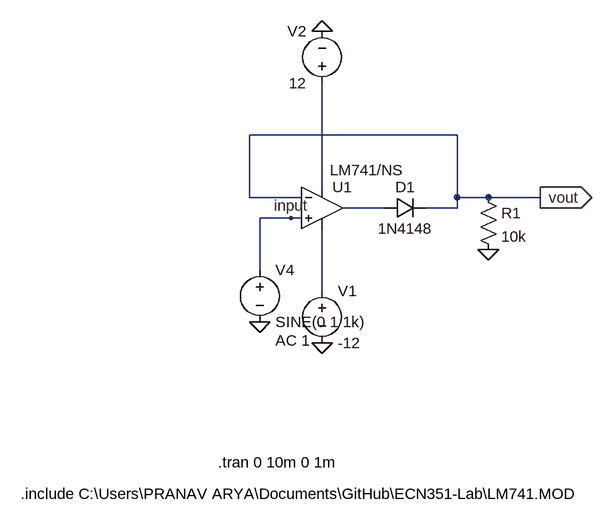
[diagram p0: schematic HalfWaweRectifier.asc]
HalfWaweRectifier.asc, the LTspice schematic file:
Version 4
SHEET 1 932 680
WIRE 672 -128 352 -128
WIRE 464 -48 464 -208
WIRE 352 -32 352 -128
WIRE 432 -32 352 -32
WIRE 672 -32 672 -128
WIRE 720 -32 672 -32
WIRE 800 -32 720 -32
WIRE 560 -16 496 -16
WIRE 672 -16 672 -32
WIRE 672 -16 624 -16
WIRE 416 0 368 0
WIRE 432 0 416 0
WIRE 368 80 368 0
WIRE 464 112 464 16
FLAG 464 192 0
FLAG 464 -288 0
FLAG 368 160 0
FLAG 416 0 input
FLAG 720 48 0
FLAG 800 -32 vout
IOPIN 800 -32 Out
SYMBOL OpAmps\\opamp2 464 -80 R0
WINDOW 3 12 6 Left 2
SYMATTR Value LM741/NS
SYMATTR InstName U1
SYMBOL voltage 464 96 R0
WINDOW 123 0 0 Left 0
WINDOW 39 0 0 Left 0
SYMATTR InstName V1
SYMATTR Value -12
SYMBOL voltage 464 -192 R180
WINDOW 0 24 96 Left 2
WINDOW 3 24 16 Left 2
WINDOW 123 0 0 Left 0
WINDOW 39 0 0 Left 0
SYMATTR InstName V2
SYMATTR Value 12
SYMBOL voltage 368 64 R0
WINDOW 123 24 124 Left 2
WINDOW 39 0 0 Left 0
SYMATTR Value2 AC 1
SYMATTR InstName V4
SYMATTR Value SINE(0 1 1k)
SYMBOL diode 560 0 R270
WINDOW 0 32 32 VTop 2
WINDOW 3 0 32 VBottom 2
SYMATTR InstName D1
SYMATTR Value 1N4148
SYMBOL res 704 -48 R0
SYMATTR InstName R1
SYMATTR Value 10k
TEXT 0 424 Left 2 !.include C:\\Users\\PRANAV ARYA\\Documents\\GitHub\\ECN351-Lab\\LM741.MOD
TEXT 304 376 Left 2 !.tran 0 10m 0 1m

The netlist it stands for:
* HalfWaweRectifier.asc
XU1 input vout N001 N003 N002 LM741/NS  ; pins In+ In- V+ V- OUT
V1 N003 0 -12
V2 N001 0 12
V4 input 0 SINE(0 1 1k) AC 1
D1 N002 vout 1N4148
R1 vout 0 10k
.model D D
.lib standard.dio
.include C:\Users\PRANAV ARYA\Documents\GitHub\ECN351-Lab\LM741.MOD
.tran 0 10m 0 1m
.backanno
.end